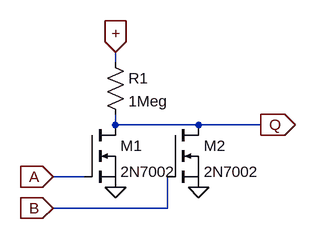
[diagram p0: schematic NOR2.asc]
NOR2.asc, the LTspice schematic file:
Version 4
SHEET 1 880 680
WIRE 272 144 272 128
WIRE 272 240 272 224
WIRE 400 240 272 240
WIRE 496 240 400 240
WIRE 224 320 176 320
WIRE 352 368 352 320
WIRE 352 368 176 368
FLAG 272 336 0
FLAG 176 320 A
IOPIN 176 320 In
FLAG 496 240 Q
IOPIN 496 240 Out
FLAG 272 128 +
IOPIN 272 128 In
FLAG 400 336 0
FLAG 176 368 B
IOPIN 176 368 In
SYMBOL nmos 224 240 R0
SYMATTR InstName M1
SYMATTR Value 2N7002
SYMBOL res 256 128 R0
SYMATTR InstName R1
SYMATTR Value 1Meg
SYMBOL nmos 352 240 R0
SYMATTR InstName M2
SYMATTR Value 2N7002

The netlist it stands for:
* NOR2.asc
M1 Q A 0 0 2N7002
R1 + Q 1Meg
M2 Q B 0 0 2N7002
.model NMOS NMOS
.model PMOS PMOS
.lib standard.mos
.backanno
.end